# Altium schematic sheet 1_overview.SchDoc
size A4; SheetNumber: 1; SheetTotal: 7
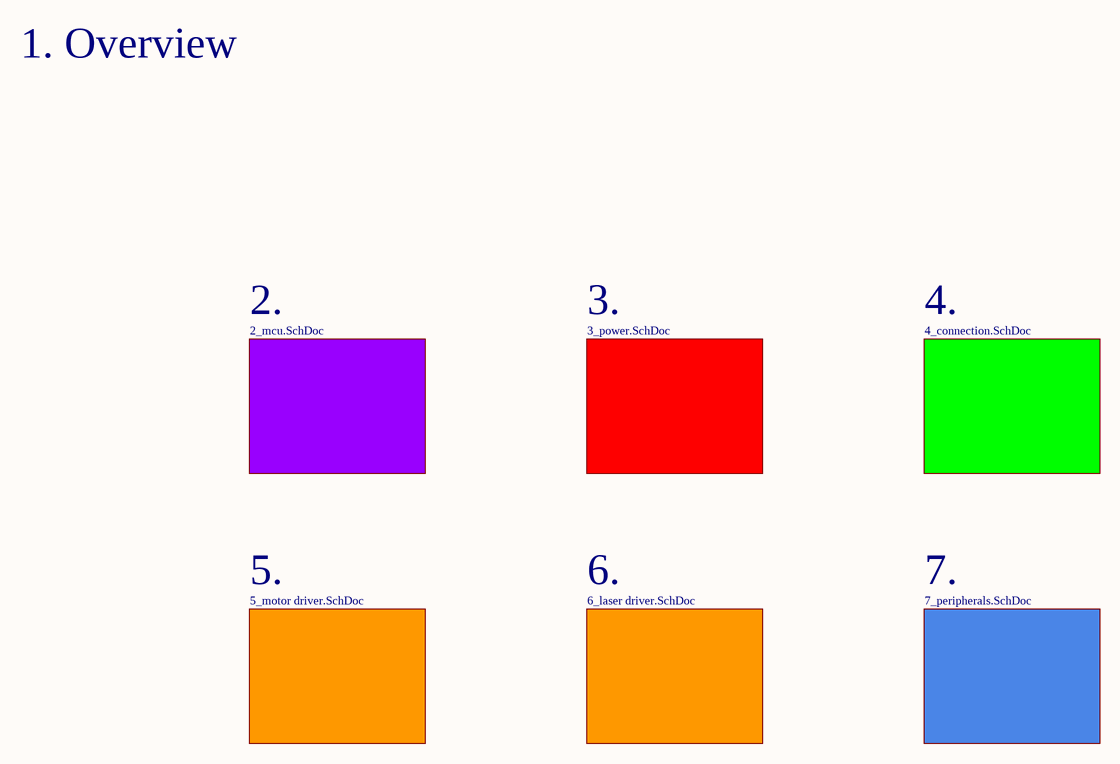
[diagram p0: 1_overview.SchDoc]

## Sub-sheets
Designator = 2_mcu.SchDoc: no entries
Designator = 3_power.SchDoc: no entries
Designator = 4_connection.SchDoc: no entries
Designator = 5_motor driver.SchDoc: no entries
Designator = 6_laser driver.SchDoc: no entries
Designator = 7_peripherals.SchDoc: no entries

## Notes on the sheet
- 1. Overview
- 2.
- 3.
- 4.
- 5.
- 6.
- 7.